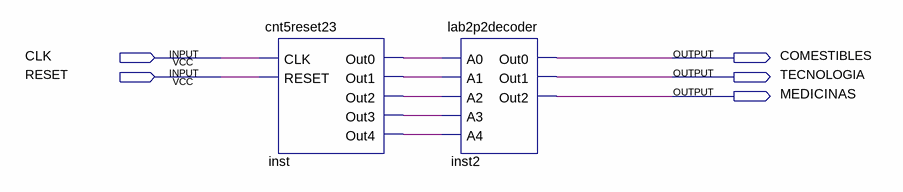
[diagram p0: schematic sheet]
// Quartus schematic lab2p2.bdf as structural Verilog: 2 symbols, 5 pins
module lab2p2 (
  input  CLK,
  input  RESET,
  output COMESTIBLES,
  output TECNOLOGIA,
  output MEDICINAS
);

  wire inst_out0, inst_out1, inst_out2, inst_out3, inst_out4;

  cnt5reset23 inst (
    .CLK(CLK), .RESET(RESET), .Out0(inst_out0), .Out1(inst_out1), .Out2(inst_out2), .Out3(inst_out3),
    .Out4(inst_out4));
  lab2p2decoder inst2 (
    .A0(inst_out0), .A1(inst_out1), .A2(inst_out2), .A3(inst_out3), .A4(inst_out4), .Out0(COMESTIBLES),
    .Out1(TECNOLOGIA), .Out2(MEDICINAS));
endmodule
